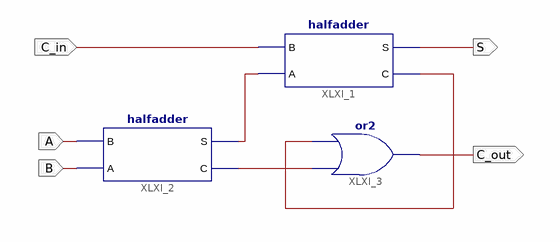
[diagram p0: schematic sheet 1]
// Xilinx ISE schematic fulladder.sch (spartan3) as structural Verilog: 3 symbols, 5 ports
module fulladder (
  input  C_in,
  input  A,
  input  B,
  output C_out,
  output S
);

  wire XLXN_5, XLXN_6, XLXN_7;

  halfadder XLXI_1 (.B(C_in), .A(XLXN_5), .S(S), .C(XLXN_7));
  halfadder XLXI_2 (.B(A), .A(B), .S(XLXN_5), .C(XLXN_6));
  or XLXI_3 (C_out, XLXN_6, XLXN_7);
endmodule
